# Altium schematic sheet MEMS_USB.SchDoc
size A4; SheetNumber: 4; SheetTotal: 5
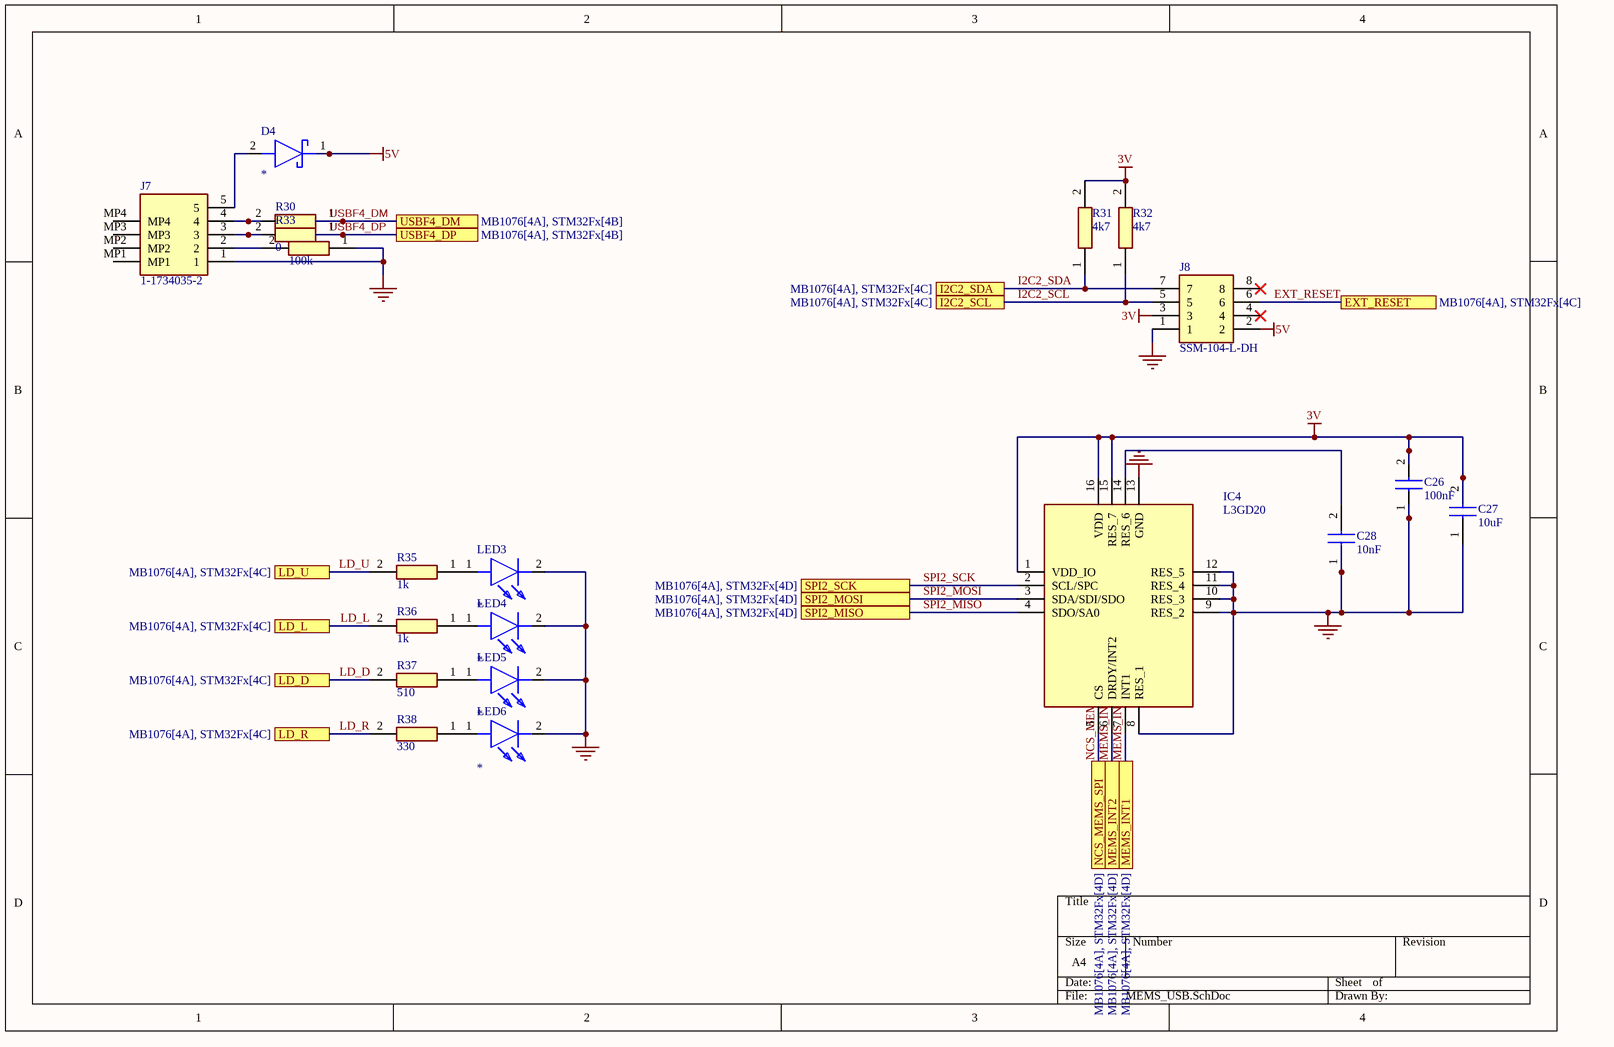
[diagram p0: MEMS_USB.SchDoc]

## Parts
C26  100nF  [ECHU_J1_J2_17_21]
C27  10uF  [ECHU_J1_J2_17_21]
C28  10nF  [ECHU_J1_J2_17_21]
D4  *  [SOD2513X117N]
IC4  L3GD20  [QFN65P400X400X100-16N]
J7  1-1734035-2  [117340352]
J8  SSM-104-L-DH  [SSM-104-XXX-DH]
LED3  *  [19213R6CAP1Q2B3T]
LED4  *  [19213R6CAP1Q2B3T]
LED5  *  [19213R6CAP1Q2B3T]
LED6  *  [19213R6CAP1Q2B3T]
R30  0  [RESC2012X60N]
R31  4k7  [RESC2012X60N]
R32  4k7  [RESC2012X60N]
R33  0  [RESC2012X60N]
R34  100k  [RESC2012X60N]
R35  1k  [RESC2012X60N]
R36  1k  [RESC2012X60N]
R37  510  [RESC2012X60N]
R38  330  [RESC2012X60N]

## Ports
EXT_RESET (see MB1076[4A], STM32Fx[4C]), I2C2_SCL (see MB1076[4A], STM32Fx[4C]), I2C2_SDA (see MB1076[4A], STM32Fx[4C]), LD_D (see MB1076[4A], STM32Fx[4C]), LD_L (see MB1076[4A], STM32Fx[4C]), LD_R (see MB1076[4A], STM32Fx[4C]), LD_U (see MB1076[4A], STM32Fx[4C]), MEMS_INT1 (see MB1076[4A], STM32Fx[4D]), MEMS_INT2 (see MB1076[4A], STM32Fx[4D]), NCS_MEMS_SPI (see MB1076[4A], STM32Fx[4D]), SPI2_MISO (see MB1076[4A], STM32Fx[4D]), SPI2_MOSI (see MB1076[4A], STM32Fx[4D]), SPI2_SCK (see MB1076[4A], STM32Fx[4D]), USBF4_DM (see MB1076[4A], STM32Fx[4B]), USBF4_DP (see MB1076[4A], STM32Fx[4B])

## Nets
3V: C26.2 C27.2 IC4.1(VDD_IO) IC4.15(RES_7) IC4.16(VDD) J8.3 R31.2 R32.2
5V: D4.1(K) J8.2
GND: C26.1 C27.1 C28.1 IC4.8(RES_1) IC4.9(RES_2) IC4.10(RES_3) IC4.11(RES_4) IC4.12(RES_5) IC4.13(GND) J7.1 J8.1 LED3.2(K) LED4.2(K) LED5.2(K) LED6.2(K) R34.1
EXT_RESET: J8.6 ; port EXT_RESET
I2C2_SCL: J8.5 R32.1 ; port I2C2_SCL
I2C2_SDA: J8.7 R31.1 ; port I2C2_SDA
LD_D: R37.2 ; port LD_D
LD_L: R36.2 ; port LD_L
LD_R: R38.2 ; port LD_R
LD_U: R35.2 ; port LD_U
MEMS_INT1: IC4.7(INT1) ; port MEMS_INT1
MEMS_INT2: IC4.6(DRDY/INT2) ; port MEMS_INT2
NCS_MEMS_SPI: IC4.5(CS) ; port NCS_MEMS_SPI
SPI2_MISO: IC4.4(SDO/SA0) ; port SPI2_MISO
SPI2_MOSI: IC4.3(SDA/SDI/SDO) ; port SPI2_MOSI
SPI2_SCK: IC4.2(SCL/SPC) ; port SPI2_SCK
USBF4_DM: R30.1 ; port USBF4_DM
USBF4_DP: R33.1 ; port USBF4_DP
NetC28_2: C28.2 IC4.14(RES_6)
NetD4_2: D4.2(A) J7.5
NetJ7_2: J7.2 R34.2
NetJ7_3: J7.3 R33.2
NetJ7_4: J7.4 R30.2
NetLED3_1: LED3.1(A) R35.1
NetLED4_1: LED4.1(A) R36.1
NetLED5_1: LED5.1(A) R37.1
NetLED6_1: LED6.1(A) R38.1

Not connected (* = marked no-connect by the designer): J7 MP1 MP2 MP3 MP4; J8 4* 8*

## Library data of the parts
C26-C28 = ECH-U1H102GX5: Capacitor; Manufacturer_Name: Panasonic; Datasheet Link: http://industrial.panasonic.com/cdbs/www-data/pdf/RDI0000/ABD0000C173.pdf; Manufacturer_Part_Number: ECH-U1H102GX5; Mouser Part Number: 667-ECH-U1H102GX5; Mouser Price/Stock: https://www.mouser.co.uk/ProductDetail/Panasonic/ECH-U1H102GX5?qs=DWeLBnRir%2FIlo4Nc0F6AmQ%3D%3D; Arrow Part Number: ECH-U1H102GX5; Arrow Price/Stock: https://www.arrow.com/en/products/echu1h102gx5/panasonic?region=europe
D4 = BAT60JFILM: Schottky Diode; Manufacturer_Name: STMicroelectronics; Datasheet Link: https://www.mouser.jp/datasheet/2/389/cd00001944-1795661.pdf; Height: 1.17mm; Manufacturer_Part_Number: BAT60JFILM; Mouser Part Number: 511-BAT60JFILM; Mouser Price/Stock: https://www.mouser.co.uk/ProductDetail/STMicroelectronics/BAT60JFILM?qs=GnFZssByvVVVnMaukcyLZg%3D%3D; Arrow Part Number: BAT60JFILM; Arrow Price/Stock: https://www.arrow.com/en/products/bat60jfilm/stmicroelectronics?region=nac
IC4 = L3GD20: Integrated Circuit; Manufacturer_Name: STMicroelectronics; Datasheet Link: http://www.mouser.com/datasheet/2/389/l3gd20-954745.pdf; Height: 1mm; Manufacturer_Part_Number: L3GD20; Mouser Part Number: 511-L3GD20; Mouser Price/Stock: https://www.mouser.co.uk/ProductDetail/STMicroelectronics/L3GD20?qs=LYO3r17CQdPwKetw3Km8nw%3D%3D
J7 = 1-1734035-2: Connector; Manufacturer_Name: TE Connectivity; Datasheet Link: https://www.arrow.com/en/products/1-1734035-2/te-connectivity; Height: 4.08mm; Manufacturer_Part_Number: 1-1734035-2; Mouser Part Number: 571-1-1734035-2; Mouser Price/Stock: https://www.mouser.co.uk/ProductDetail/TE-Connectivity/1-1734035-2?qs=vnwGVgFuQiZQrcvyrtufjA%3D%3D; Arrow Part Number: 1-1734035-2; Arrow Price/Stock: https://www.arrow.com/en/products/1-1734035-2/te-connectivity?region=nac
J8 = SSM-104-L-DH: Connector; Manufacturer_Name: SAMTEC; Datasheet Link: http://suddendocs.samtec.com/prints/ssm-1xx-xxx-xx-xx-xx-x-xx-xx-mkt.pdf; Manufacturer_Part_Number: SSM-104-L-DH; Mouser Part Number: 200-SSM104LDH; Mouser Price/Stock: https://www.mouser.co.uk/ProductDetail/Samtec/SSM-104-L-DH?qs=rU5fayqh%252BE2%252BZRQJ2nT%2FIw%3D%3D; Arrow Part Number: SSM-104-L-DH; Arrow Price/Stock: https://www.arrow.com/en/products/ssm-104-l-dh/samtec?utm_currency=USD&region=nac
LED3-LED6 = 19-213-R6C-AP1Q2B-3T: LED; Manufacturer_Name: Everlight; Datasheet Link: https://www.arrow.com/en/products/19-213-r6c-ap1q2b-3t/everlight-electronics; Height: 0.7mm; Manufacturer_Part_Number: 19-213-R6C-AP1Q2B-3T; Arrow Part Number: 19-213-R6C-AP1Q2B-3T; Arrow Price/Stock: https://www.arrow.com/en/products/19-213-r6c-ap1q2b-3t/everlight-electronics?region=nac
R30-R38 = RK73H2ATTD5111F: Resistor; Manufacturer_Name: KOA Speer; Datasheet Link: http://www.koaspeer.com/catimages/Products/RK73H/RK73H.pdf; Height: 0.6mm; Manufacturer_Part_Number: RK73H2ATTD5111F